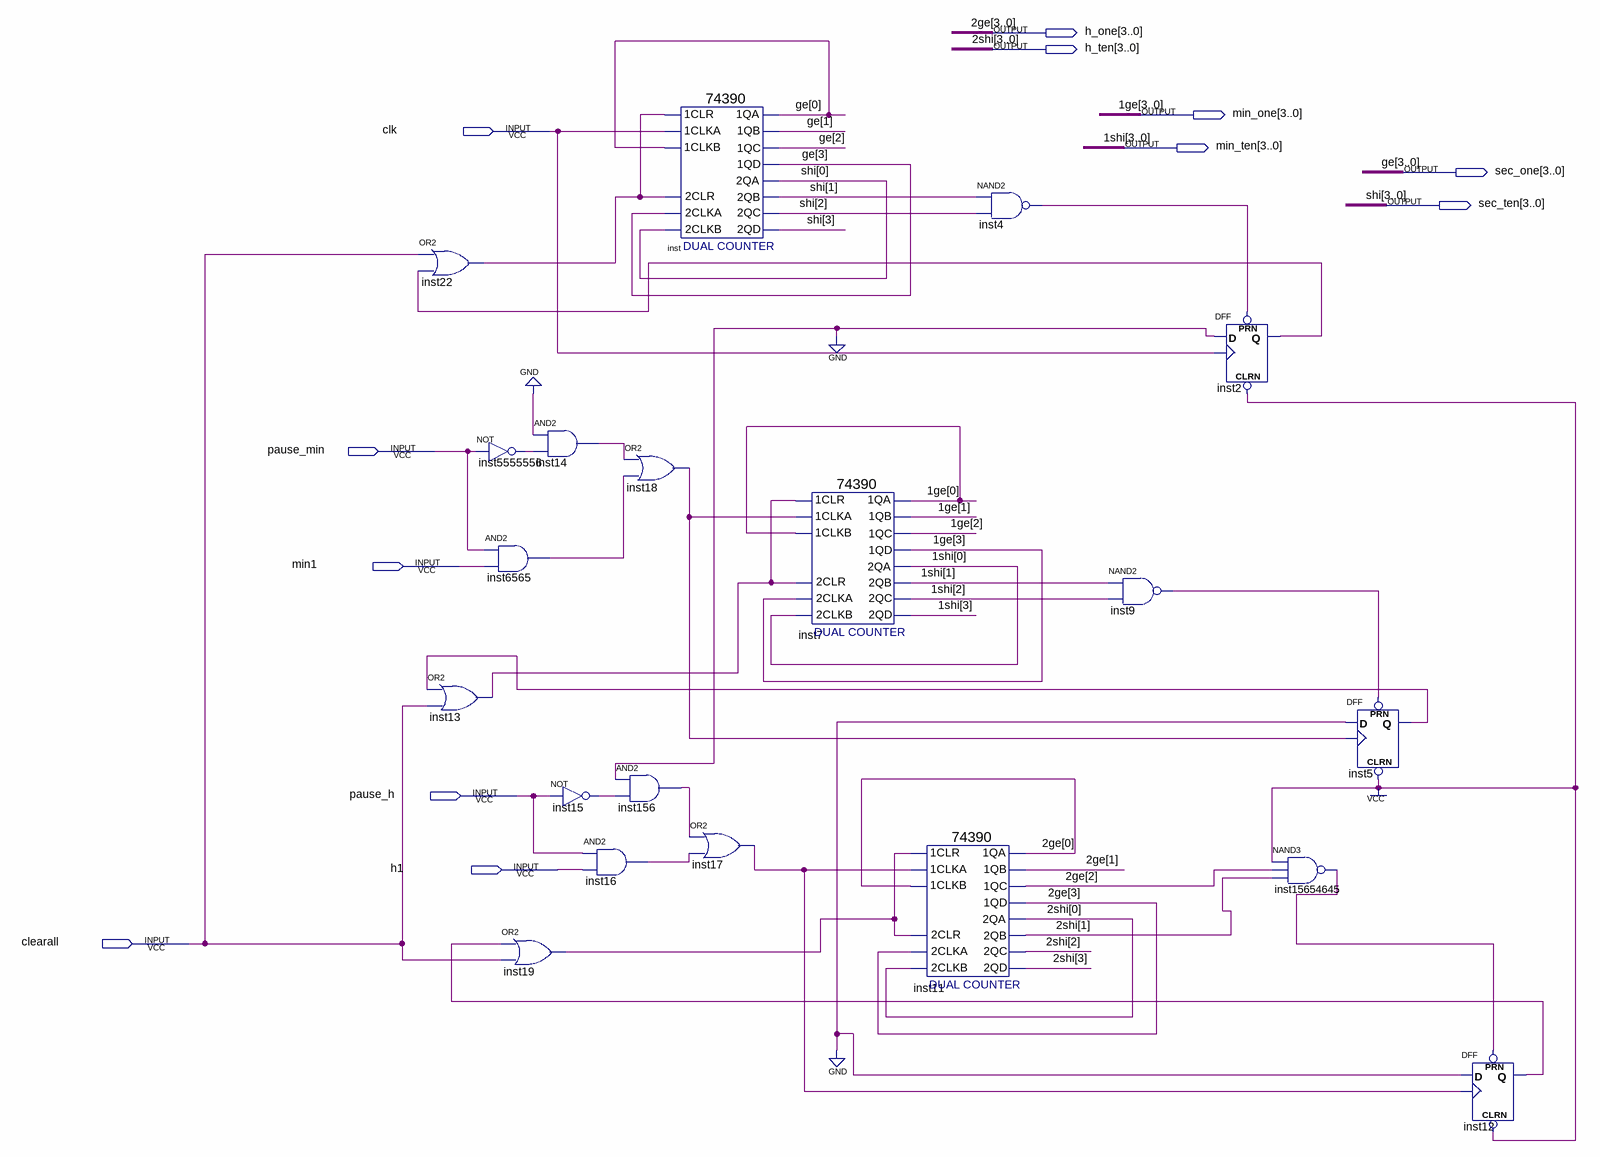
[diagram p0: schematic sheet]
// Quartus schematic alarmcntall.bdf as structural Verilog: 20 symbols, 12 pins
module alarmcntall (
  input  clk,
  input  pause_min,
  input  min1,
  input  pause_h,
  input  h1,
  input  clearall,
  output [3:0] h_one,
  output [3:0] h_ten,
  output [3:0] min_one,
  output [3:0] min_ten,
  output [3:0] sec_one,
  output [3:0] sec_ten
);

  wire inst2_q, inst4_out, inst5_q, inst9_out, inst12_q, inst13_out, inst14_out, inst15_out, inst16_out,
       inst17_out, inst18_out, inst19_out, inst22_out, inst156_out, inst6565_out, inst5555556_out,
       inst15654645_out;

  or inst22 (inst22_out, clearall, inst2_q);
  not inst5555556 (inst5555556_out, pause_min);
  or inst13 (inst13_out, inst5_q, clearall);
  and inst14 (inst14_out, 1'b0, inst5555556_out);
  and inst6565 (inst6565_out, pause_min, min1);
  or inst19 (inst19_out, inst12_q, clearall);
  not inst15 (inst15_out, pause_h);
  and inst16 (inst16_out, pause_h, h1);
  \74390  inst (
    .\2CLKA (sec_one[3]), .\2CLR (inst22_out), .\2CLKB (sec_ten[0]), .\1CLR (inst22_out), .\1CLKA (clk),
    .\1CLKB (sec_one[0]), .\1QA (sec_one[0]), .\1QB (sec_one[1]), .\1QC (sec_one[2]), .\1QD (sec_one[3]),
    .\2QA (sec_ten[0]), .\2QB (sec_ten[1]), .\2QC (sec_ten[2]), .\2QD (sec_ten[3]));
  or inst18 (inst18_out, inst14_out, inst6565_out);
  and inst156 (inst156_out, 1'b0, inst15_out);
  or inst17 (inst17_out, inst156_out, inst16_out);
  \74390  inst7 (
    .\2CLKA (min_one[3]), .\2CLR (inst13_out), .\2CLKB (min_ten[0]), .\1CLR (inst13_out),
    .\1CLKA (inst18_out), .\1CLKB (min_one[0]), .\1QA (min_one[0]), .\1QB (min_one[1]), .\1QC (min_one[2]),
    .\1QD (min_one[3]), .\2QA (min_ten[0]), .\2QB (min_ten[1]), .\2QC (min_ten[2]), .\2QD (min_ten[3]));
  \74390  inst11 (
    .\2CLKA (h_one[3]), .\2CLR (inst19_out), .\2CLKB (h_ten[0]), .\1CLR (inst19_out), .\1CLKA (inst17_out),
    .\1CLKB (h_one[0]), .\1QA (h_one[0]), .\1QB (h_one[1]), .\1QC (h_one[2]), .\1QD (h_one[3]),
    .\2QA (h_ten[0]), .\2QB (h_ten[1]), .\2QC (h_ten[2]), .\2QD (h_ten[3]));
  nand inst4 (inst4_out, sec_ten[1], sec_ten[2]);
  nand inst9 (inst9_out, min_ten[1], min_ten[2]);
  DFF inst2 (.CLRN(1'b1), .CLK(clk), .D(1'b0), .PRN(inst4_out), .Q(inst2_q));
  nand inst15654645 (inst15654645_out, 1'b1, h_one[2], h_ten[1]);
  DFF inst5 (.CLRN(1'b1), .CLK(inst18_out), .D(1'b0), .PRN(inst9_out), .Q(inst5_q));
  DFF inst12 (.CLRN(1'b1), .CLK(inst17_out), .D(1'b0), .PRN(inst15654645_out), .Q(inst12_q));

  // Other names for the same wires on the sheet: 1ge[3:0] = min_one; 1shi[3:0] = min_ten; 2ge[3:0] = h_one;
  //   2shi[3:0] = h_ten; ge[3:0] = sec_one; shi[3:0] = sec_ten
endmodule
